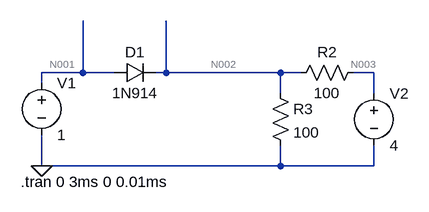
[diagram p0: schematic Diode Test.asc]
Diode Test.asc, the LTspice schematic file:
Version 4
SHEET 1 880 680
WIRE 96 144 96 64
WIRE 96 144 32 144
WIRE 144 144 96 144
WIRE 224 144 224 64
WIRE 224 144 208 144
WIRE 400 144 224 144
WIRE 432 144 400 144
WIRE 544 144 512 144
WIRE 32 160 32 144
WIRE 400 176 400 144
WIRE 544 176 544 144
WIRE 32 288 32 240
WIRE 400 288 400 256
WIRE 400 288 32 288
WIRE 544 288 544 256
WIRE 544 288 400 288
FLAG 32 288 0
SYMBOL diode 144 160 R270
WINDOW 0 32 32 VTop 2
WINDOW 3 0 32 VBottom 2
SYMATTR InstName D1
SYMATTR Value 1N914
SYMBOL voltage 32 144 R0
WINDOW 123 0 0 Left 0
WINDOW 39 0 0 Left 0
SYMATTR InstName V1
SYMATTR Value 1
SYMBOL res 528 128 R90
WINDOW 0 0 56 VBottom 2
WINDOW 3 32 56 VTop 2
SYMATTR InstName R2
SYMATTR Value 100
SYMBOL voltage 544 160 R0
WINDOW 123 0 0 Left 0
WINDOW 39 0 0 Left 0
SYMATTR InstName V2
SYMATTR Value 4
SYMBOL res 384 160 R0
SYMATTR InstName R3
SYMATTR Value 100
TEXT 0 312 Left 2 !.tran 0 3ms 0 0.01ms

The netlist it stands for:
* Diode Test.asc
D1 N001 N002 1N914
V1 N001 0 1
R2 N003 N002 100
V2 N003 0 4
R3 N002 0 100
.model D D
.lib standard.dio
.tran 0 3ms 0 0.01ms
.backanno
.end

* Results of the author's LTspice run, read from the files saved beside the schematic
* Operating Point, zero values left out:
*   V(n001) = 1 V
*   V(n002) = 2 V
*   V(n003) = 4 V
*   I(D1) = -2.521 nA
*   I(R3) = 20 mA
*   I(R2) = 20 mA
*   I(V2) = -20 mA
*   I(V1) = 2.521 nA